# EAGLE design Bean_revE (EAGLE 7.1.0)
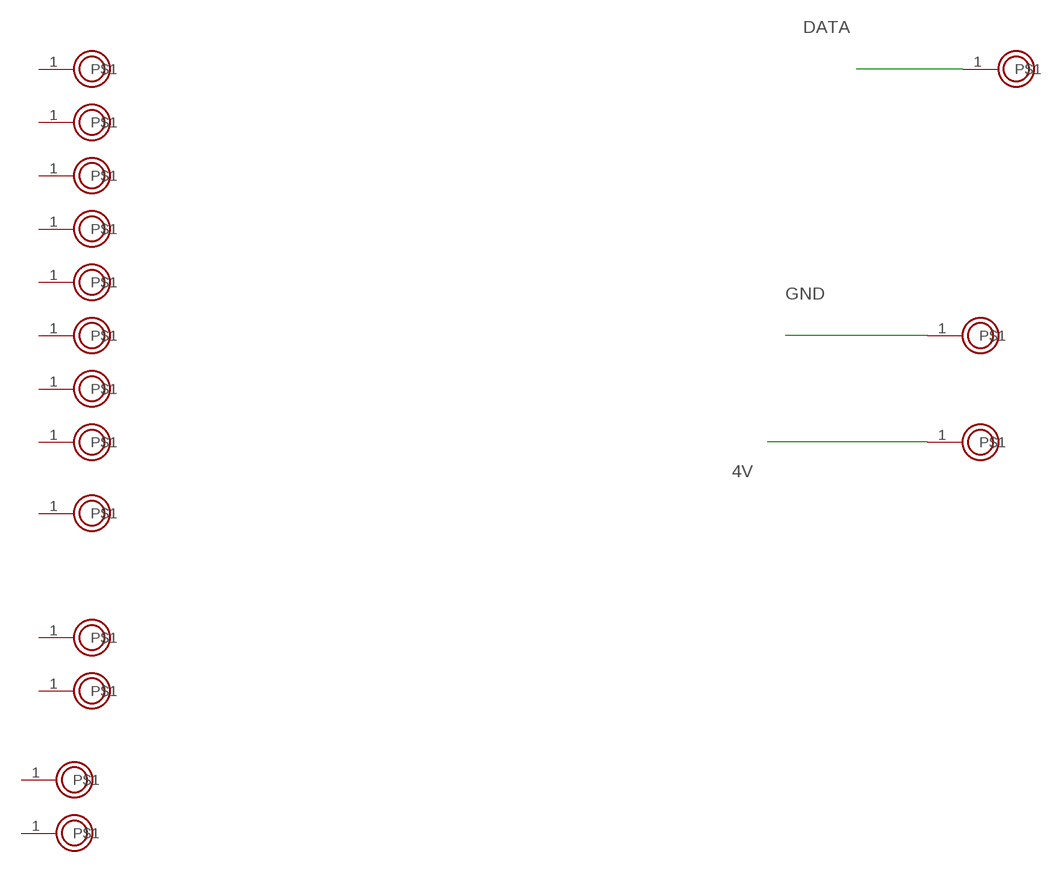
[diagram p0: schematic, sheet 1]

## Parts
0  PROTO_POINT  [1X01]
1  PROTO_POINT  [1X01]
2  PROTO_POINT  [1X01]
3  PROTO_POINT  [1X01]
4  PROTO_POINT  [1X01]
4V  PROTO_POINT  [1X01]
5  PROTO_POINT  [1X01]
A0  PROTO_POINT  [1X01]
A1  PROTO_POINT  [1X01]
BAT  PROTO_POINT  [1X01]
DATA  PROTO_POINT  [1X01]
GND@1  PROTO_POINT  [1X01]
GND@2  PROTO_POINT  [1X01]
GND@3  PROTO_POINT  [1X01]
RESET  PROTO_POINT  [1X01]
VCC  PROTO_POINT  [1X01]

## Nets
4V: 4V.1
DATA: DATA.1
GND: GND@1.1
Unconnected: 0.1 1.1 2.1 3.1 4.1 5.1 A0.1 A1.1 BAT.1 GND@2.1 GND@3.1 RESET.1 VCC.1

## Library data of the parts
0 1-4 4V 5 A0 A1 BAT DATA GND@1-GND@3 RESET VCC = BLEduino Bean:PROTO_POINT

## Board
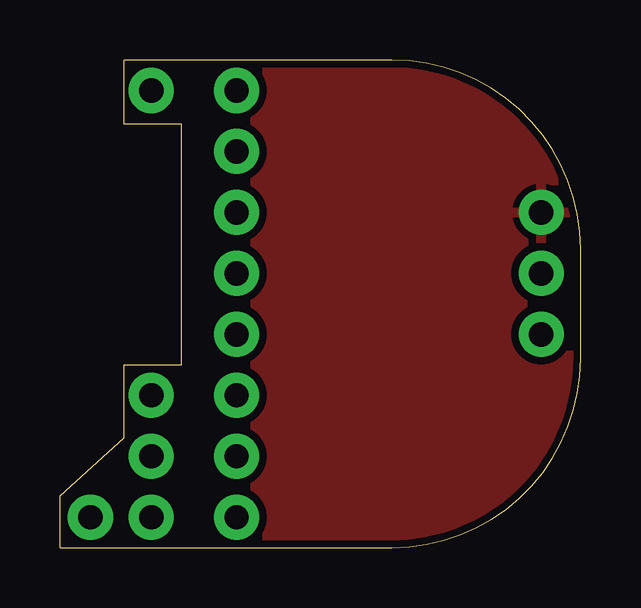
[diagram p1: board, top side]

Size 21.72 x 20.32 mm. Coordinates in mm from the lower left corner, seen from the top.
Outline: 0,0 13.84,0 arc90 21.72,7.87 21.72,12.45 arc90 13.84,20.32 2.67,20.32 2.67,17.65 5.08,17.65 5.08,7.62 2.67,7.62 2.67,4.57 0,2.16 0,0
Copper layers (1*16): Top 0.035mm / dielectric 1.5mm / Bottom 0.035mm
Design rules "default *": minimum track width 7mil, minimum drill 0.15mm, track to track 5mil, track to pad 5mil, pad to pad 5mil, via to via 5mil, smd to smd 1mil, copper to edge 8mil, drill to drill 8mil, minimum pad ring 10mil, minimum via ring 2mil, stop-mask expansion 2mil, vias tented up to drill 13mil, thermal gap 10mil

### Footprints (pad centres in the part's own frame; a part is rotated, then mirrored left to right if it is on the bottom)
1X01 = drill 1.016 pad 1.88: 1 0,0

### Placement (x,y rotation side)
0  7.37,6.35 0 top
1  7.37,8.89 0 top
2  7.37,11.43 0 top
3  7.37,13.97 0 top
4  7.37,16.51 0 top
4V  20.07,11.43 0 top
5  7.37,19.05 0 top
A0  7.37,1.27 0 top
A1  7.37,3.81 0 top
BAT  1.27,1.27 0 top
DATA  20.07,8.89 0 top
GND@1  20.07,13.97 0 top
GND@2  3.81,1.27 0 top
GND@3  3.81,19.05 0 top
RESET  3.81,3.81 0 top
VCC  3.81,6.35 0 top

### Tracks (layer width: path | path; a pad name or v marks a point on that pad's centre or on a via)
GND
  pour Top (isolate 0.305): 13.84,20.32 arc-90 21.59,12.45 arc-90 21.72,12.45 21.72,7.87 arc-90 13.84,0 0,0 0,2.16 2.67,4.57 2.67,7.62 5.08,7.62 5.08,17.65 2.67,17.65 2.67,20.32

### Text on the board
Document: Bean Revision E | ray@ | P/N: PTD1013012E | punchthrough.com | ck@ | Rev E | Top Silk: tPlace tArt | Bottom Silk: bArt | Layers: 2 | Rectangular Dimensions: 1.775" x 0.8" (45.09mm x 20.32mm) | Finished Thickness: 0.062" | Finish: ENIG | Material: FR4 | Copper Weight: 1oz | Soldermask: Top and bottom | Silkscreen: Top and Bottom | Silkscreen Color: Black | Soldermask Color: 85% white 10% green 5% blue | Min Drill: 0.008" | Min Annular Ring: 0.006" | Min Trace: 0.007" | Min Spacing: 0.005" | Corner mill radius: 0.32" | Avoid placing copper in antenna keepout